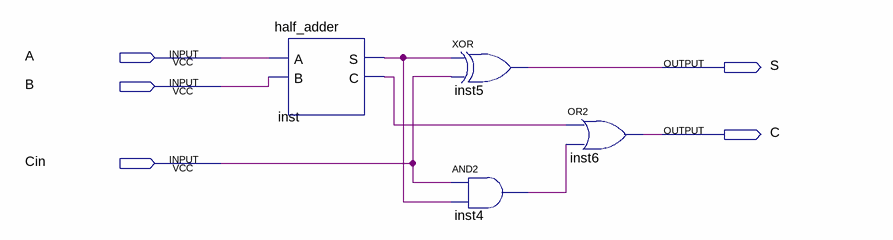
[diagram p0: schematic sheet]
// Quartus schematic full_adder.bdf as structural Verilog: 4 symbols, 5 pins
module full_adder (
  input  A,
  input  B,
  input  Cin,
  output S,
  output C
);

  wire inst4_out, inst_c, inst_s;

  half_adder inst (.A(A), .B(B), .S(inst_s), .C(inst_c));
  xor inst5 (S, inst_s, Cin);
  and inst4 (inst4_out, Cin, inst_s);
  or inst6 (C, inst_c, inst4_out);
endmodule
